# EAGLE design LineSensor (EAGLE 9.7.0)
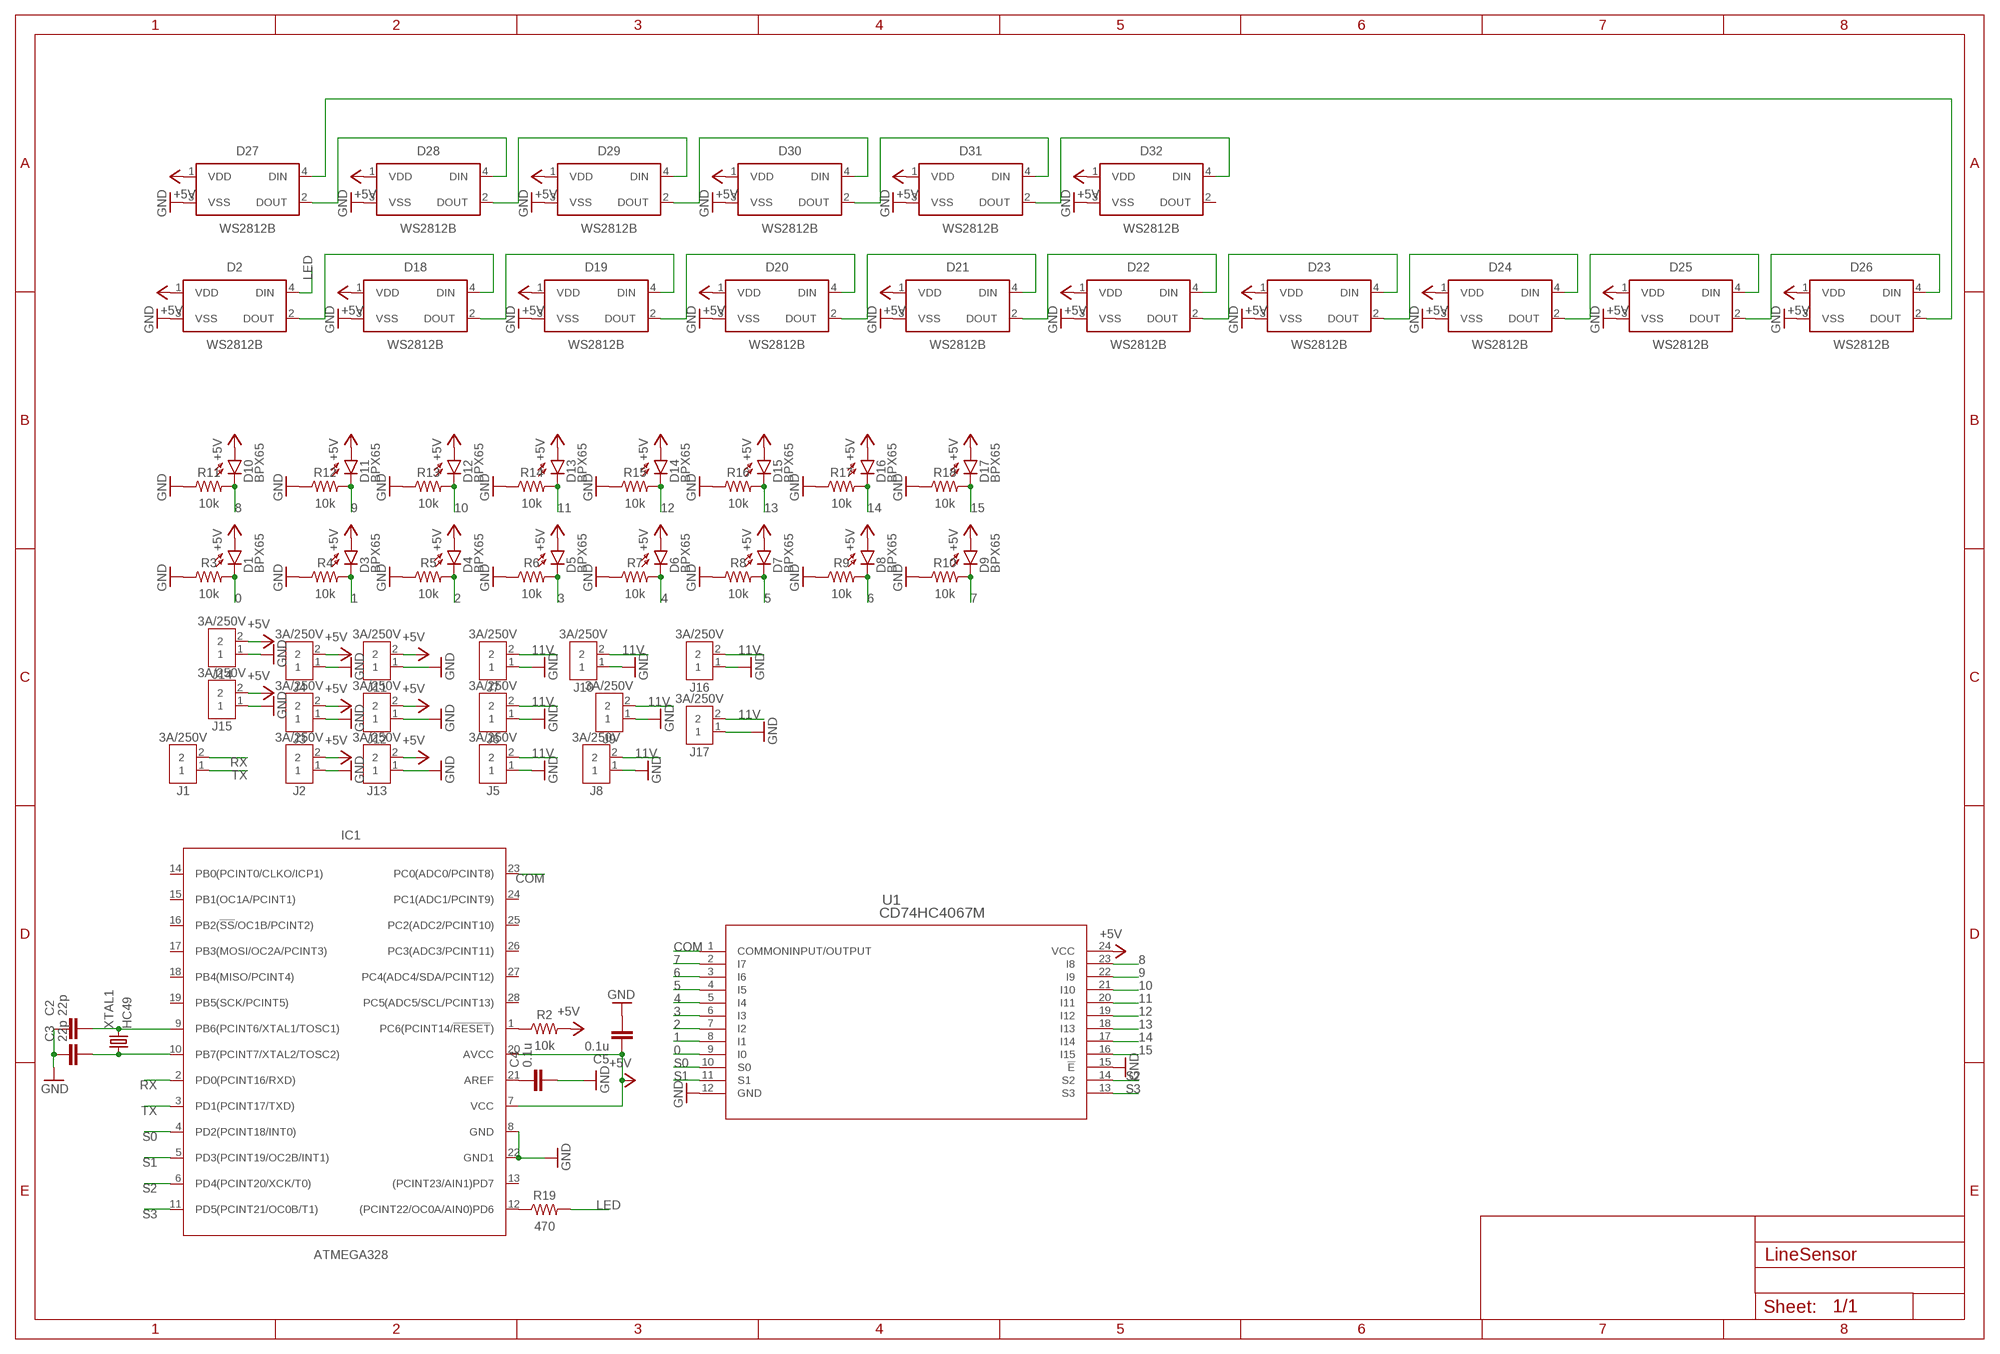
[diagram p0: schematic, sheet 1]

## Parts
C2  22p  C_CHIP-0603(1608-METRIC)  [CAPC1608X85]
C3  22p  C_CHIP-0603(1608-METRIC)  [CAPC1608X85]
C4  0.1u  C_CHIP-0603(1608-METRIC)  [CAPC1608X85]
C5  0.1u  C_CHIP-0603(1608-METRIC)  [CAPC1608X85]
D1  BPX65  [BPX65]
D2  WS2812B  [WS2812B]
D3  BPX65  [BPX65]
D4  BPX65  [BPX65]
D5  BPX65  [BPX65]
D6  BPX65  [BPX65]
D7  BPX65  [BPX65]
D8  BPX65  [BPX65]
D9  BPX65  [BPX65]
D10  BPX65  [BPX65]
D11  BPX65  [BPX65]
D12  BPX65  [BPX65]
D13  BPX65  [BPX65]
D14  BPX65  [BPX65]
D15  BPX65  [BPX65]
D16  BPX65  [BPX65]
D17  BPX65  [BPX65]
D18  WS2812B  [WS2812B]
D19  WS2812B  [WS2812B]
D20  WS2812B  [WS2812B]
D21  WS2812B  [WS2812B]
D22  WS2812B  [WS2812B]
D23  WS2812B  [WS2812B]
D24  WS2812B  [WS2812B]
D25  WS2812B  [WS2812B]
D26  WS2812B  [WS2812B]
D27  WS2812B  [WS2812B]
D28  WS2812B  [WS2812B]
D29  WS2812B  [WS2812B]
D30  WS2812B  [WS2812B]
D31  WS2812B  [WS2812B]
D32  WS2812B  [WS2812B]
IC1  ATMEGA328  ATMEGA328_DIP  [DIP1016W53P254L3467H457Q28B]
J1  3A/250V  B2B-XH-A  [B2B-XH-A]
J2  3A/250V  B2B-XH-A  [B2B-XH-A]
J3  3A/250V  B2B-XH-A  [B2B-XH-A]
J4  3A/250V  B2B-XH-A  [B2B-XH-A]
J5  3A/250V  B2B-XH-A  [B2B-XH-A]
J6  3A/250V  B2B-XH-A  [B2B-XH-A]
J7  3A/250V  B2B-XH-A  [B2B-XH-A]
J8  3A/250V  B2B-XH-A  [B2B-XH-A]
J9  3A/250V  B2B-XH-A  [B2B-XH-A]
J10  3A/250V  B2B-XH-A  [B2B-XH-A]
J11  3A/250V  B2B-XH-A  [B2B-XH-A]
J12  3A/250V  B2B-XH-A  [B2B-XH-A]
J13  3A/250V  B2B-XH-A  [B2B-XH-A]
J14  3A/250V  B2B-XH-A  [B2B-XH-A]
J15  3A/250V  B2B-XH-A  [B2B-XH-A]
J16  3A/250V  B2B-XH-A  [B2B-XH-A]
J17  3A/250V  B2B-XH-A  [B2B-XH-A]
R2  10k  R-US_CHIP-0603(1608-METRIC)  [RESC1608X60]
R3  10k  R-US_CHIP-0603(1608-METRIC)  [RESC1608X60]
R4  10k  R-US_CHIP-0603(1608-METRIC)  [RESC1608X60]
R5  10k  R-US_CHIP-0603(1608-METRIC)  [RESC1608X60]
R6  10k  R-US_CHIP-0603(1608-METRIC)  [RESC1608X60]
R7  10k  R-US_CHIP-0603(1608-METRIC)  [RESC1608X60]
R8  10k  R-US_CHIP-0603(1608-METRIC)  [RESC1608X60]
R9  10k  R-US_CHIP-0603(1608-METRIC)  [RESC1608X60]
R10  10k  R-US_CHIP-0603(1608-METRIC)  [RESC1608X60]
R11  10k  R-US_CHIP-0603(1608-METRIC)  [RESC1608X60]
R12  10k  R-US_CHIP-0603(1608-METRIC)  [RESC1608X60]
R13  10k  R-US_CHIP-0603(1608-METRIC)  [RESC1608X60]
R14  10k  R-US_CHIP-0603(1608-METRIC)  [RESC1608X60]
R15  10k  R-US_CHIP-0603(1608-METRIC)  [RESC1608X60]
R16  10k  R-US_CHIP-0603(1608-METRIC)  [RESC1608X60]
R17  10k  R-US_CHIP-0603(1608-METRIC)  [RESC1608X60]
R18  10k  R-US_CHIP-0603(1608-METRIC)  [RESC1608X60]
R19  470  R-US_CHIP-0603(1608-METRIC)  [RESC1608X60]
U1  CD74HC4067M  [DW24]
XTAL1  HC49  CRYSTAL_HC49-11.5L  [XTALRR488W45L1150T500H350B]

## Nets
0: D1.K(C) R3.2 U1.9(I0)
1: D3.K(C) R4.2 U1.8(I1)
2: D4.K(C) R5.2 U1.7(I2)
3: D5.K(C) R6.2 U1.6(I3)
4: D6.K(C) R7.2 U1.5(I4)
5: D7.K(C) R8.2 U1.4(I5)
6: D8.K(C) R9.2 U1.3(I6)
7: D9.K(C) R10.2 U1.2(I7)
8: D10.K(C) R11.2 U1.23(I8)
9: D11.K(C) R12.2 U1.22(I9)
10: D12.K(C) R13.2 U1.21(I10)
11: D13.K(C) R14.2 U1.20(I11)
11V [11V]: J5.2 J6.2 J7.2 J8.2 J9.2 J10.2 J16.2 J17.2
12: D14.K(C) R15.2 U1.19(I12)
13: D15.K(C) R16.2 U1.18(I13)
14: D16.K(C) R17.2 U1.17(I14)
15: D17.K(C) R18.2 U1.16(I15)
+5V [power]: C5.1 D1.A D2.1(VDD) D3.A D4.A D5.A D6.A D7.A D8.A D9.A D10.A D11.A D12.A D13.A D14.A D15.A D16.A D17.A D18.1(VDD) D19.1(VDD) D20.1(VDD) D21.1(VDD) D22.1(VDD) D23.1(VDD) D24.1(VDD) D25.1(VDD) D26.1(VDD) D27.1(VDD) D28.1(VDD) D29.1(VDD) D30.1(VDD) D31.1(VDD) D32.1(VDD) IC1.7(VCC) IC1.20(AVCC) J2.2 J3.2 J4.2 J11.2 J12.2 J13.2 J14.2 J15.2 R2.2 U1.24(VCC)
COM: IC1.23(PC0(ADC0/PCINT8)) U1.1(COMMONINPUT/OUTPUT)
GND [power]: C2.1 C3.1 C4.2 C5.2 D2.3(VSS) D18.3(VSS) D19.3(VSS) D20.3(VSS) D21.3(VSS) D22.3(VSS) D23.3(VSS) D24.3(VSS) D25.3(VSS) D26.3(VSS) D27.3(VSS) D28.3(VSS) D29.3(VSS) D30.3(VSS) D31.3(VSS) D32.3(VSS) IC1.8(GND) IC1.22(GND1) J2.1 J3.1 J4.1 J5.1 J6.1 J7.1 J8.1 J9.1 J10.1 J11.1 J12.1 J13.1 J14.1 J15.1 J16.1 J17.1 R3.1 R4.1 R5.1 R6.1 R7.1 R8.1 R9.1 R10.1 R11.1 R12.1 R13.1 R14.1 R15.1 R16.1 R17.1 R18.1 U1.12(GND) U1.15(!E)
LED: D2.4(DIN) R19.2
N$1: C2.2 IC1.9(PB6(PCINT6/XTAL1/TOSC1)) XTAL1.2
N$2: C3.2 IC1.10(PB7(PCINT7/XTAL2/TOSC2)) XTAL1.1
N$3: C4.1 IC1.21(AREF)
N$4: IC1.1(PC6(PCINT14/!RESET!)) R2.1
N$5: D2.2(DOUT) D18.4(DIN)
N$6: D18.2(DOUT) D19.4(DIN)
N$7: D19.2(DOUT) D20.4(DIN)
N$8: D20.2(DOUT) D21.4(DIN)
N$9: D21.2(DOUT) D22.4(DIN)
N$10: D22.2(DOUT) D23.4(DIN)
N$11: D23.2(DOUT) D24.4(DIN)
N$12: D24.2(DOUT) D25.4(DIN)
N$13: D25.2(DOUT) D26.4(DIN)
N$14: D26.2(DOUT) D27.4(DIN)
N$15: D27.2(DOUT) D28.4(DIN)
N$16: D28.2(DOUT) D29.4(DIN)
N$17: D29.2(DOUT) D30.4(DIN)
N$18: D30.2(DOUT) D31.4(DIN)
N$19: D31.2(DOUT) D32.4(DIN)
N$20: IC1.12((PCINT22/OC0A/AIN0)PD6) R19.1
RX: IC1.2(PD0(PCINT16/RXD)) J1.2
S0: IC1.4(PD2(PCINT18/INT0)) U1.10(S0)
S1: IC1.5(PD3(PCINT19/OC2B/INT1)) U1.11(S1)
S2: IC1.6(PD4(PCINT20/XCK/T0)) U1.14(S2)
S3: IC1.11(PD5(PCINT21/OC0B/T1)) U1.13(S3)
TX: IC1.3(PD1(PCINT17/TXD)) J1.1
Unconnected: D32.2(DOUT) IC1.13((PCINT23/AIN1)PD7) IC1.14(PB0(PCINT0/CLKO/ICP1)) IC1.15(PB1(OC1A/PCINT1)) IC1.16(PB2(!SS!/OC1B/PCINT2)) IC1.17(PB3(MOSI/OC2A/PCINT3)) IC1.18(PB4(MISO/PCINT4)) IC1.19(PB5(SCK/PCINT5)) IC1.24(PC1(ADC1/PCINT9)) IC1.25(PC2(ADC2/PCINT10)) IC1.26(PC3(ADC3/PCINT11)) IC1.27(PC4(ADC4/SDA/PCINT12)) IC1.28(PC5(ADC5/SCL/PCINT13))

## Library data of the parts
C2-C5 = Capacitor:C: Capacitor - Generic; CATEGORY: Capacitor
D1 D3-D17 = opto-trans-siemens:BPX65: PHOTO DIODE; MPN: BPX65.; OC_FARNELL: 327451; OC_NEWARK: 06WX2764
D2 D18-D32 = LED:WS2812B: Intelligent control LED integrated light source Datasheet <http://cdn.sparkfun.com/datasheets/BreakoutBoards/WS2812B.pdf>; CATEGORY: LED; COLOR: RGB; DESCRIPTION: LED integrated light source; MANUFACTURER: Worldsemi; MPN: WS2812B; OPERATING_TEMP: -25 ℃ to +80℃(TJ); PART_STATUS: Active; SUB_CATEGORY: RGB
IC1 = IC_Embedded:ATMEGA328: 8-bit AVR Microcontroller with 32K Bytes In-System Programmable Flash Datasheet <http://ww1.microchip.com/downloads/en/DeviceDoc/ATmega48A-PA-88A-PA-168A-PA-328-P-DS-DS40002061A.pdf>; CATEGORY: IC_Embedded; MANUFACTURER: Microchip Technologies; MPN: ATmega328-PN; OPERATING_TEMP: –40 to +105°C; PART_STATUS: Active; SUB-CATEGORY: Microcontroller
J1-J17 = Connector:B2B-XH-A: XH Connector Top Entry - 2POS Details see: Datasheet <http://www.jst-mfg.com/product/pdf/eng/eXH.pdf>; CATEGORY: CONNECTOR; DESCRIPTION: 2.5mm pitch/disconnectable crimp style connector; MANUFACTURER: JST (XH CONNECTOR); MPN: B2B-XH-A; OPERATING_TEMPERATURE: -25°C ~ 85°C; PART_STATUS: ACTIVE; ROHS_COMPLIANT: COMPLIANT; SERIES: B_B-XH-A; SUB_CATEGORY: Through hole connector; TYPE: top entry
R2-R19 = Resistor:R-US: Resistor Fixed - ANSI; CATEGORY: Resistor; SUB-CATEGORY: Fixed
U1 = CD74HC4067:CD74HC4067M; COPYRIGHT: Copyright (C) 2022 Ultra Librarian. All rights reserved.; MANUFACTURER_PART_NUMBER: CD74HC4067M; MFR_NAME: Texas Instruments
XTAL1 = Frequency-Source:CRYSTAL: Crystal 2Pin - Generic; CATEGORY: Frequency-Source; SUB-CATEGORY: Crystal-2Pin

## Net classes
1 11V: width 3.302 mm
2 power: width 1.27 mm

## Board
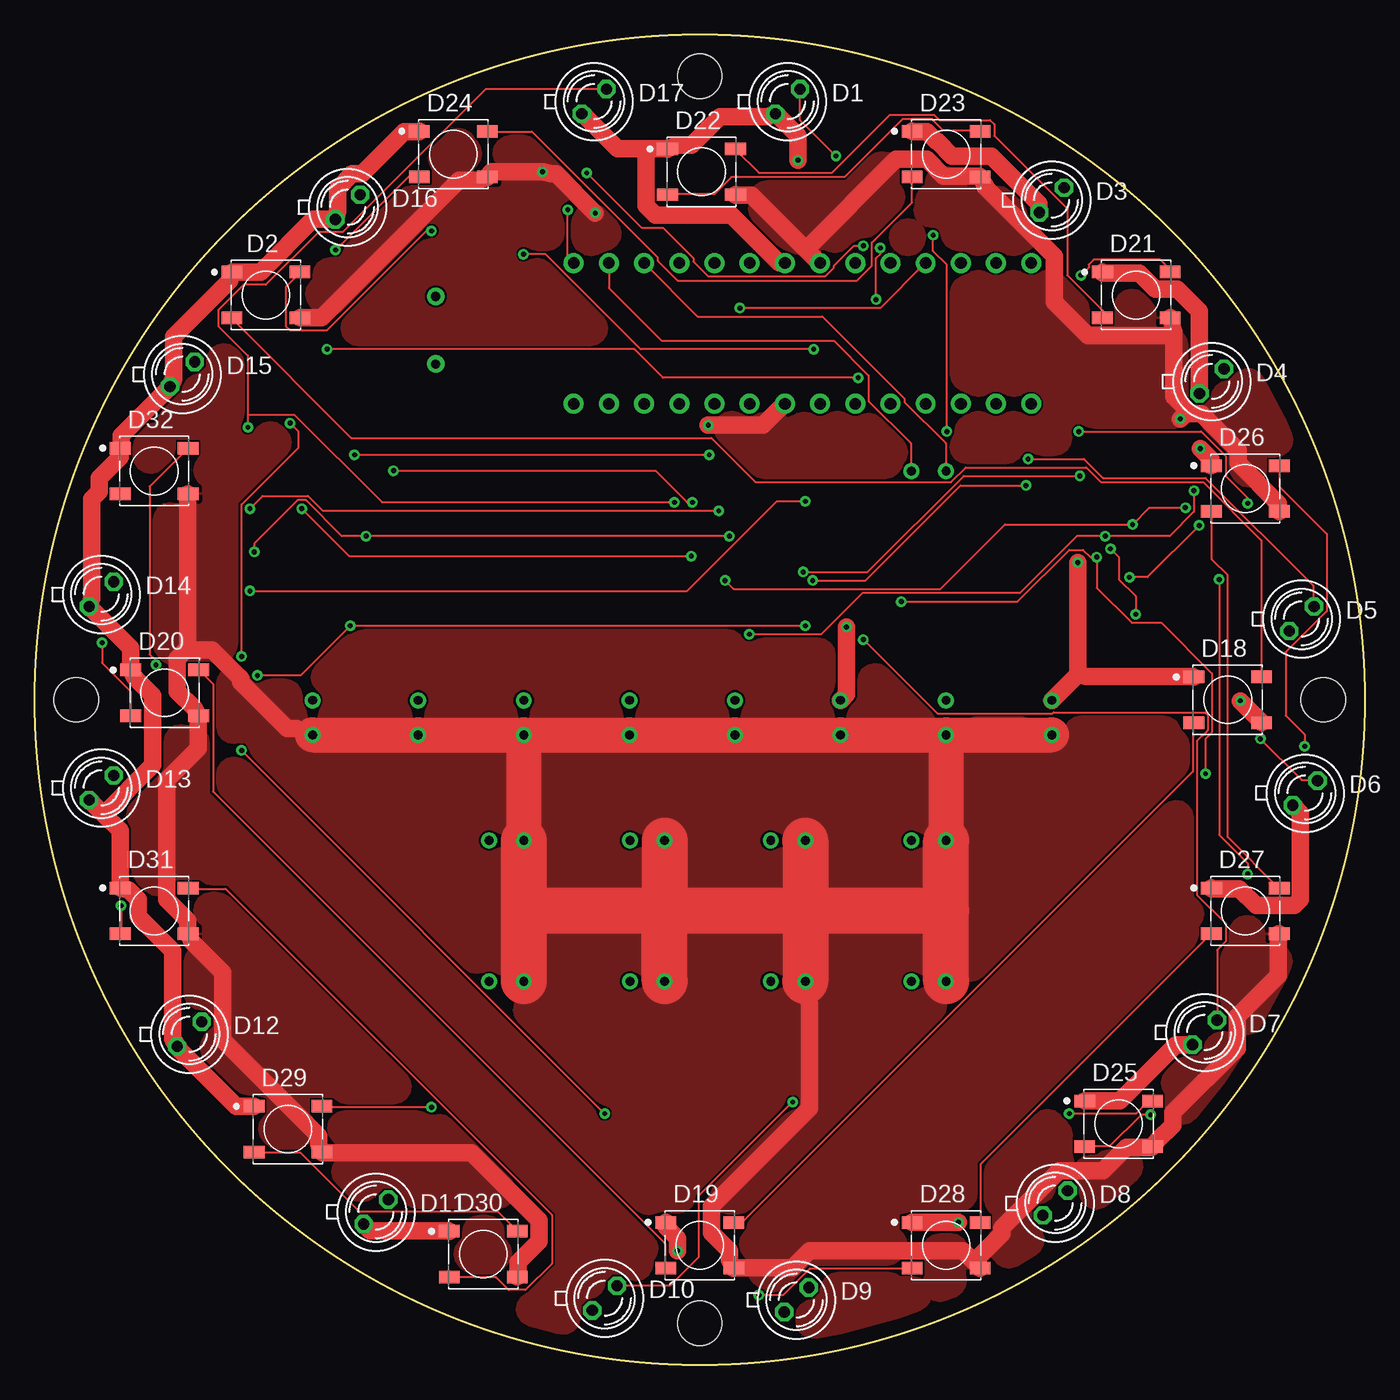
[diagram p1: board, top side]
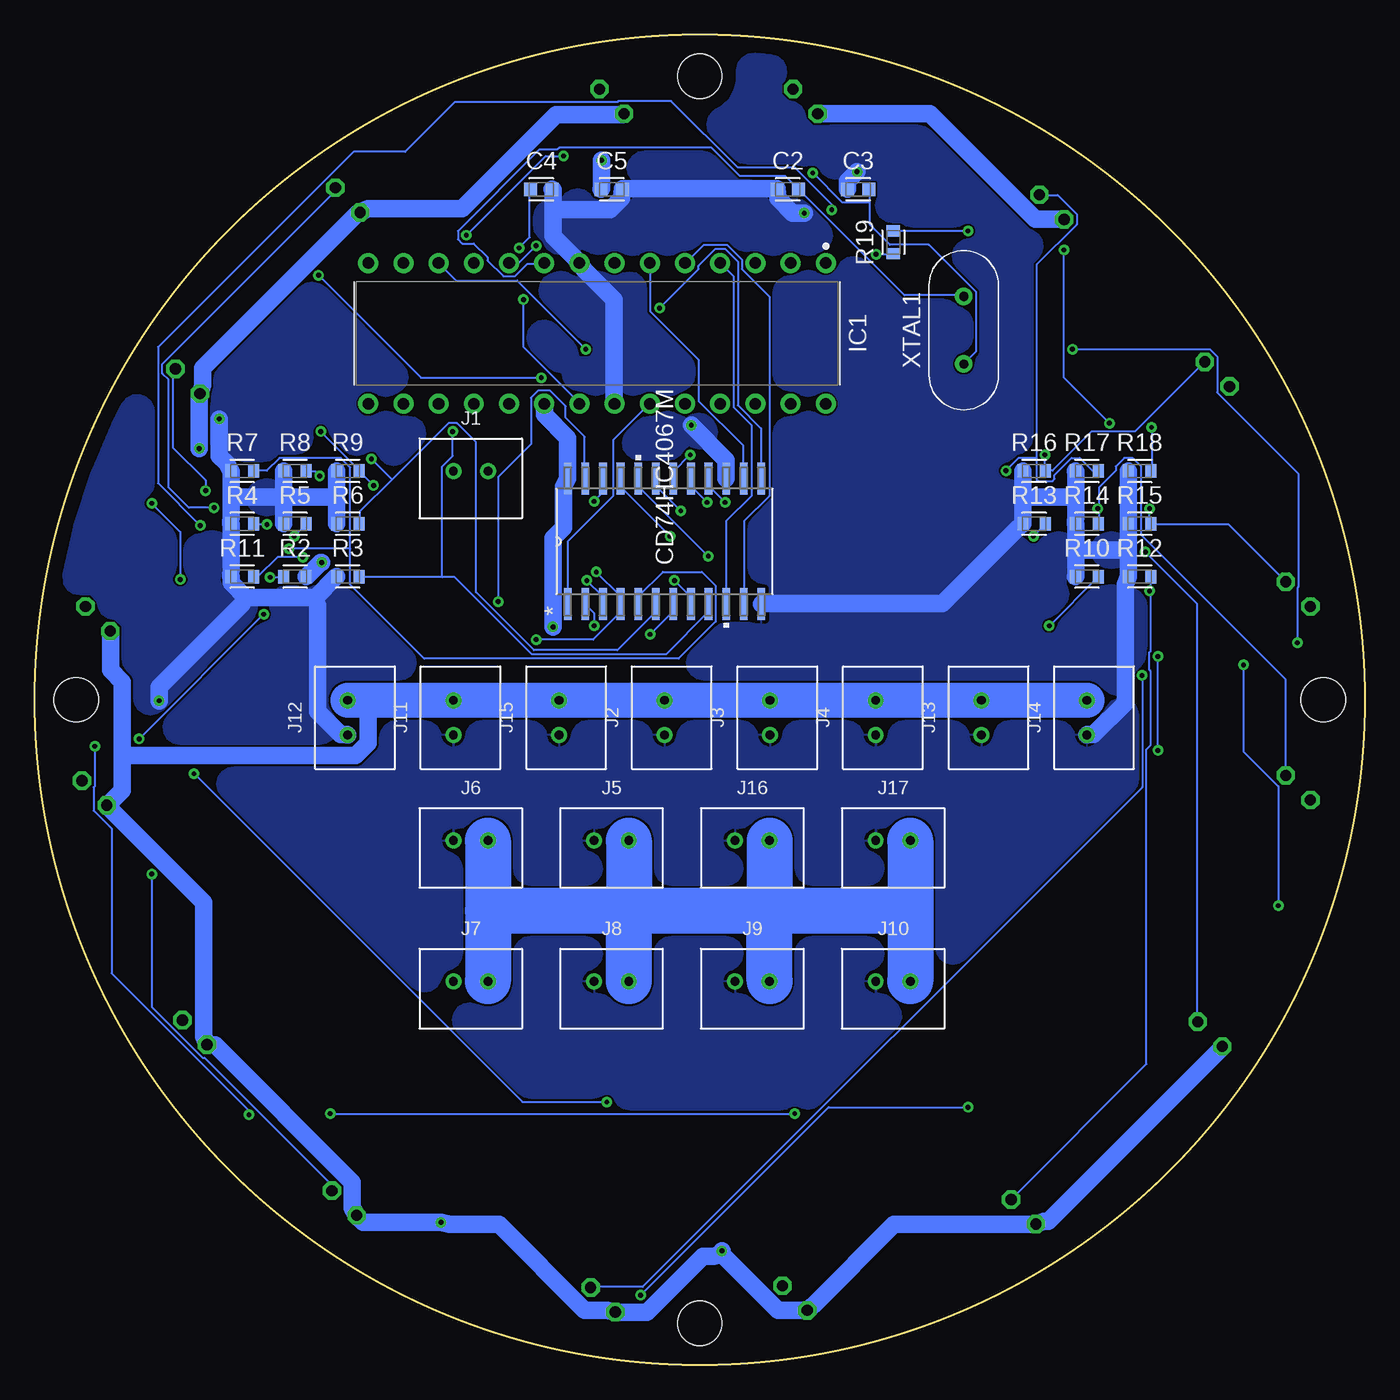
[diagram p2: board, bottom side, seen from below]

Size 96 x 96 mm. Coordinates in mm from the lower left corner, seen from the top.
Outline: circle at 48,48 radius 48
Copper layers (1*16): Top 0.035mm / dielectric 1.5mm / Bottom 0.035mm
Design rules "default": minimum track width 6mil, minimum drill 0.35mm, track to track 6mil, track to pad 6mil, pad to pad 6mil, via to via 6mil, smd to smd 6mil, copper to edge 40mil, drill to drill 6mil, minimum pad ring 10mil, minimum via ring 8mil, stop-mask expansion 4mil, vias tented up to drill 0mil, thermal gap 10mil
Holes 3.2 mm at 3,48 48,3 93,48 48,93

### Footprints (pad centres in the part's own frame; a part is rotated, then mirrored left to right if it is on the bottom)
CAPC1608X85 = smd 0.921 x 0.97: 1 -0.775,0; 2 0.775,0
BPX65 = drill 0.813 octagon: A -0.889,-0.889; K 0.889,0.889
WS2812B = smd 1.5 x 0.9: 1 -2.45,1.65; 2 -2.45,-1.65; 3 2.45,-1.65; 4 2.45,1.65
DIP1016W53P254L3467H457Q28B = drill 0.841 pad 1.441: 1 -5.08,16.51; 2 -5.08,13.97; 3 -5.08,11.43; 4 -5.08,8.89; 5 -5.08,6.35; 6 -5.08,3.81; 7 -5.08,1.27; 8 -5.08,-1.27; 9 -5.08,-3.81; 10 -5.08,-6.35; 11 -5.08,-8.89; 12 -5.08,-11.43; 13 -5.08,-13.97; 14 -5.08,-16.51; 15 5.08,-16.51; 16 5.08,-13.97; 17 5.08,-11.43; 18 5.08,-8.89; 19 5.08,-6.35; 20 5.08,-3.81; 21 5.08,-1.27; 22 5.08,1.27; 23 5.08,3.81; 24 5.08,6.35; 25 5.08,8.89; 26 5.08,11.43; 27 5.08,13.97; 28 5.08,16.51
B2B-XH-A = drill 0.64: 1 0,0; 2 2.5,0
RESC1608X60 = smd 0.799 x 0.974: 1 -0.815,0; 2 0.815,0
DW24 = smd 2.311 x 0.559: 1 -4.521,6.985; 2 -4.521,5.715; 3 -4.521,4.445; 4 -4.521,3.175; 5 -4.521,1.905; 6 -4.521,0.635; 7 -4.521,-0.635; 8 -4.521,-1.905; 9 -4.521,-3.175; 10 -4.521,-4.445; 11 -4.521,-5.715; 12 -4.521,-6.985; 13 4.521,-6.985; 14 4.521,-5.715; 15 4.521,-4.445; 16 4.521,-3.175; 17 4.521,-1.905; 18 4.521,-0.635; 19 4.521,0.635; 20 4.521,1.905; 21 4.521,3.175; 22 4.521,4.445; 23 4.521,5.715; 24 4.521,6.985
XTALRR488W45L1150T500H350B = drill 0.657 pad 1.257: 1 -2.44,0; 2 2.44,0

### Placement (x,y rotation side)
C2  41.65,84.83 0 bottom
C3  36.57,84.83 0 bottom
C4  59.43,84.83 0 bottom
C5  54.35,84.83 0 bottom
D1  54.35,91.18 0 top
D2  16.69,77.21 0 top
D3  73.4,84.07 0 top
D4  84.96,70.99 0 top
D5  91.43,53.84 0 top
D6  91.69,41.27 0 top
D7  84.45,24 0 top
D8  73.65,11.68 0 top
D9  54.98,4.69 0 top
D10  41.14,4.82 0 top
D11  24.63,11.04 0 top
D12  11.17,23.87 0 top
D13  4.82,41.65 0 top
D14  4.82,55.62 0 top
D15  10.66,71.5 0 top
D16  22.6,83.56 0 top
D17  40.38,91.18 0 top
D18  86.1,48 0 top
D19  48,8.63 0 top
D20  9.39,48.51 0 top
D21  79.5,77.21 0 top
D22  48.13,86.1 0 top
D23  65.78,87.37 0 top
D24  30.22,87.37 0 top
D25  78.23,17.39 0 top
D26  87.37,63.24 0 top
D27  87.37,32.76 0 top
D28  65.78,8.63 0 top
D29  18.28,17.01 0 top
D30  32.38,7.99 0 top
D31  8.63,32.76 0 top
D32  8.63,64.51 0 top
IC1  55.41,74.44 270 bottom
J1  65.78,64.51 0 bottom
J2  50.54,45.46 90 bottom
J3  42.92,45.46 90 bottom
J4  35.3,45.46 90 bottom
J5  55.62,37.84 0 bottom
J6  65.78,37.84 0 bottom
J7  65.78,27.68 0 bottom
J8  55.62,27.68 0 bottom
J9  45.46,27.68 0 bottom
J10  35.3,27.68 0 bottom
J11  65.78,45.46 90 bottom
J12  73.4,45.46 90 bottom
J13  27.68,45.46 90 bottom
J14  20.06,45.46 90 bottom
J15  58.16,45.46 90 bottom
J16  45.46,37.84 0 bottom
J17  35.3,37.84 0 bottom
R2  77.21,56.89 0 bottom
R3  73.4,56.89 0 bottom
R4  81.02,60.7 0 bottom
R5  77.21,60.7 0 bottom
R6  73.4,60.7 0 bottom
R7  81.02,64.51 0 bottom
R8  77.21,64.51 0 bottom
R9  73.4,64.51 0 bottom
R10  20.06,56.89 0 bottom
R11  81.02,56.89 0 bottom
R12  16.25,56.89 0 bottom
R13  23.87,60.7 0 bottom
R14  20.06,60.7 0 bottom
R15  16.25,60.7 0 bottom
R16  23.87,64.51 0 bottom
R17  20.06,64.51 0 bottom
R18  16.25,64.51 0 bottom
R19  34.03,81.02 90 bottom
U1  50.54,59.43 90 bottom
XTAL1  28.95,74.67 90 bottom

### Tracks (layer width: path | path; a pad name or v marks a point on that pad's centre or on a via)
0  (via drill 0.35)
  Top 0.152: D1.K 55.24,89.83 v57.83,87.24 | v64.84,81.53 64.84,80.38 65.83,79.39 v65.83,67.36
  Bottom 0.152: 66.59,56.84 65.68,56.84 60.12,51.28 50.44,51.28 47.39,54.33 47.39,54.86 U1.9 | 66.59,56.84 72.54,56.84 R3.2 | v57.83,87.24 59.12,87.24 v64.84,81.53 | v65.83,67.36 65.83,65.6 66.59,64.84 66.59,56.84
1  (via drill 0.35)
  Top 0.152: v49.83,56.61 50.44,56 65.37,56 70.02,60.65 v79.24,60.65 80.46,61.87 v83.05,61.87
  Bottom 0.152: v79.24,60.65 80.16,60.65 R4.2 | v49.83,56.61 48.69,55.47 48.69,54.93 U1.8 | D3.K 74.29,84.73 86.79,72.23 86.79,71.55 86.33,71.09 86.33,63.32 84.88,61.87 v83.05,61.87
2  (via drill 0.35)
  Top 0.152: v83.66,63.09 83.66,61.56 81.91,59.81 v77.26,59.81 75.2,59.81 71.09,55.7 59.73,55.7 56.76,52.72 v51.58,52.72
  Bottom 0.152: v77.26,59.81 76.42,60.65 R5.2 | v83.66,63.09 83.66,63.85 86.02,66.21 86.02,71.7 D4.K | U1.7 49.91,54.4 v51.58,52.72
3  (via drill 0.35)
  Top 0.152: v71.7,65.37 75.74,65.37 77.11,64 84.5,64 92.27,56.23 92.27,54.78 D5.K
  Bottom 0.152: 70.21,63.89 66.14,67.96 65.53,67.96 64.15,66.59 64.15,55.77 59.96,51.58 53.94,51.58 51.2,54.33 51.2,54.86 U1.6 | 70.21,63.89 72.54,61.56 72.54,60.73 R6.2 | 70.21,63.89 v71.7,65.37
4  (via drill 0.35)
  Top 0.152: v88.46,45.18 91.43,42.21 92.58,42.21 D6.K | v79.47,54.17 79.47,55.47 78.25,56.69 78.25,58.29 v77.64,58.9
  Bottom 0.152: 73.22,58.9 73.22,56.31 67.89,50.97 49.52,50.97 46.86,53.64 46.86,56.23 47.85,57.22 50.67,57.22 52.42,55.47 52.42,54.93 U1.5 | 73.22,58.9 73.22,64.76 73.91,65.45 78.33,65.45 79.24,64.53 80.16,64.53 R7.2 | v79.47,54.17 v88.46,45.18 | 73.22,58.9 v77.64,58.9
5  (via drill 0.35)
  Top 0.152: v75.43,64.15 67.05,64.15 60.12,57.22 v55.47,57.22 | D7.K 85.34,29.94 85.95,30.55 85.95,31.85 83.89,33.9 83.89,45.03 84.65,45.79 84.65,46.93 84.5,47.09 73.53,47.09 73.45,47.01 65.14,47.01 v59.81,52.34
  Bottom 0.152: v75.43,64.15 75.74,64.46 76.35,64.46 R8.2 | v55.47,57.22 53.72,55.47 U1.4 53.72,54.33 55.7,52.34 v59.81,52.34
6  (via drill 0.35)
  Top 0.152: v71.55,63.47 66.82,63.47 59.96,56.61 v56.15,56.61 | v87.55,35.43 87.55,36.19 85.49,38.25 v85.49,56.69 | v87.55,62.17 87.55,62.55 85.95,64.15 85.95,65.6 84.19,67.36 v75.36,67.36
  Bottom 0.152: v71.55,63.47 72.54,64.46 R9.2 72.54,64.53 v75.36,67.36 | v56.15,56.61 55.01,55.47 55.01,54.93 U1.3 | v87.55,35.43 87.55,25.83 83.89,22.17 83.74,22.17 74.59,13.02 74.59,12.57 D8.K | v85.49,56.69 85.49,60.12 v87.55,62.17
7  (via drill 0.35)
  Top 0.152: v55.62,53.33 v22.78,53.33 19.2,49.75 v16.07,49.75
  Bottom 0.152: v22.78,53.33 19.27,56.84 R10.2 | v55.62,53.33 55.62,54.25 56.23,54.86 U1.2 | v16.07,49.75 16.07,41.67 52.12,5.63 55.85,5.63 D9.K
8  (via drill 0.35)
  Top 0.152: v62.55,55.09 70.94,55.09 74.67,58.82 75.66,58.82 76.19,58.29 v76.65,58.29 76.65,56.08 79.17,53.56 81.3,53.56 84.96,49.91 84.96,45.64 84.5,45.18 v84.5,42.67 | D10.K 45.87,5.71 47.92,7.77 47.92,12.19 v54.71,18.97
  Bottom 0.152: v76.65,58.29 78.48,58.29 79.85,56.91 80.16,56.91 R11.2 | v62.55,55.09 62.55,64.08 60.19,66.44 60.19,69.79 59.66,70.33 58.82,70.33 57.68,69.18 57.68,68.34 56.31,66.97 56.31,64 U1.23 | v54.71,18.97 60.8,18.97 v84.5,42.67
9  (via drill 0.35)
  Top 0.152: v55.62,62.33 53.56,62.33 47.09,55.85 v15.54,55.85
  Bottom 0.152: 15.46,55.85 15.46,51.51 15.54,51.43 15.54,50.13 15.46,50.06 15.46,44.72 15.77,44.42 15.77,21.71 25.52,11.96 D11.K | 15.46,55.85 15.46,56.84 R12.2 | v55.62,62.33 55.01,62.94 55.01,63.93 U1.22 | 15.46,55.85 v15.54,55.85
10  (via drill 0.35)
  Top 0.152: v50.13,59.81 v23.92,59.81 22.17,59.81 19.58,62.4 18.97,62.4 15.84,59.28 v15.84,58.67
  Bottom 0.152: v23.92,59.81 23.08,60.65 R13.2 | v50.13,59.81 53.72,63.39 U1.21 | v15.84,58.67 12.11,54.93 12.11,24.76 D12.K
11  (via drill 0.35)
  Top 0.152: v47.39,58.36 22.7,58.36 v19.27,61.79
  Bottom 0.152: 19.2,61.79 19.2,63.32 17.98,64.53 17.98,64.84 17.37,65.45 16.76,65.45 16.15,64.84 16.15,59.89 5.71,49.45 D13.K | 19.2,61.79 19.2,60.73 R14.2 | v47.39,58.36 52.42,63.39 52.42,63.93 U1.20 | 19.2,61.79 v19.27,61.79
11V
  Bottom 3.302: J17.2 32.8,32.76 | 32.8,32.76 J10.2 | J16.2 42.96,32.76 | J9.2 42.96,32.76 | J5.2 53.12,32.76 | J8.2 53.12,32.76 | J6.2 63.28,32.76 | 63.28,32.76 J7.2 | 32.8,32.76 42.96,32.76 | 42.96,32.76 53.12,32.76 | 53.12,32.76 63.28,32.76
12  (via drill 0.35)
  Top 0.152: v49.37,61.64 20.8,61.64 19.73,62.71 16.45,62.71 v15.54,61.79
  Bottom 0.152: D14.K 5.71,56.53 9.82,60.65 15.39,60.65 R15.2 15.46,60.73 15.54,60.8 v15.54,61.79 | v49.37,61.64 51.12,63.39 51.12,63.93 U1.19
13  (via drill 0.35)
  Top 0.152: v23.08,65.68 v48.69,65.68
  Bottom 0.152: D15.K 11.58,72.38 16.61,67.36 19.73,67.36 22.55,64.53 23.01,64.53 R16.2 23.08,64.53 v23.08,65.68 | U1.18 49.91,64.46 v48.69,65.68
14  (via drill 0.35)
  Top 0.152: v47.47,62.25 47.09,62.25 44.8,64.53 v25.9,64.53
  Bottom 0.152: 23.69,65.45 23.69,79.39 20.8,82.29 20.8,83.05 22.17,84.42 23.46,84.42 D16.K | 23.69,65.45 23.69,63.93 23.54,63.77 22.55,63.77 22.4,63.93 22.4,64.23 21.18,65.45 20.57,65.45 19.65,64.53 19.27,64.53 R17.2 | v47.47,62.25 48.61,63.39 48.61,63.93 U1.17 | v25.9,64.53 24.99,65.45 23.69,65.45
15  (via drill 0.35)
  Top 0.152: 15.39,68.57 15.39,72.84 13.25,74.97 13.25,76.12 15.08,77.95 16.68,77.95 20.49,81.76 22.24,81.76 32.53,92.04 41.22,92.04 D17.K | 15.39,68.57 v15.39,67.66 | v46.17,62.25 25.06,62.25 18.74,68.57 15.39,68.57
  Bottom 0.152: v15.39,67.66 15.39,64.53 R18.2 | v46.17,62.25 47.31,63.39 47.31,63.93 U1.16
+5V  (via drill 0.35)
  Top 1.27: D27.1 84.96,34.36 86.94,34.36 88.16,33.14 90.9,33.14 91.36,33.6 91.36,39.85 90.82,40.38 D6.A | 75.28,49.83 v75.28,57.91 | 75.28,49.83 73.45,48 J12.2 | D18.1 83.59,49.68 75.89,49.68 75.28,49.83 | v58.59,53.26 58.59,48.38 58.21,48 J15.2 | D25.1 75.81,19.04 78.33,19.04 82.37,23.08 83.51,23.08 D7.A | v66.67,10.28 63.39,10.28 D28.1 | D11.A 24.23,9.67 29.86,9.67 D30.1 | v46.4,8.22 46.4,9.14 45.56,9.98 45.56,10.2 D19.1 | D23.1 63.39,89 64.38,89 65.07,88.31 65.14,88.31 66.21,87.24 69.03,87.24 72.46,83.81 72.46,83.2 D3.A | v84.12,66.14 84.88,65.37 84.88,64.92 D26.1 | D21.1 77.08,78.78 79.71,78.78 80.87,77.62 82.46,77.62 84.04,76.04 84.04,70.1 D4.A | v55.09,86.94 55.09,88.69 53.49,90.29 D1.A 52.88,90.06 49.45,90.06 47.39,88 46.25,88 D22.1 45.64,87.78 44.11,87.78 | 44.11,87.78 42.06,87.78 39.54,90.29 D17.A | 44.11,87.78 44.11,83.66 44.8,82.98 50.29,82.98 53.72,79.55 54.1,79.55 IC1.7 | D2.1 16.3,78.86 20.11,82.67 D16.A 21.86,83.28 21.86,84.88 22.93,85.95 23.62,85.95 26.66,89 27.73,89 D24.1 | D2.1 | D29.1 15.77,18.66 14.55,18.66 10.28,22.93 D12.A 9.98,23.54 9.98,29.86 7.46,32.38 7.46,33.6 6.78,34.28 D31.1 6.17,34.44 6.17,38.55 4.98,39.73 | 4.98,39.73 3.96,40.76 D13.A | 4.98,39.73 8.53,43.28 8.53,48.3 7.23,49.6 D20.1 6.93,50.21 6.93,51.73 D14.A 4.11,55.31 4.11,62.48 4.64,63.01 4.64,64 6.17,65.53 D32.1 6.24,66.21 6.24,67.05 9.75,70.56 D15.A 10.05,71.16 10.05,74.21 14.09,78.25 D2.1
  Bottom 1.27: 89.68,43.96 89.68,41.45 90.75,40.38 D6.A 90.37,39.92 83.81,33.37 83.81,23.69 D7.A 83.51,23.08 82.98,23.08 73.07,13.18 73.07,11.35 D8.A 72.77,10.74 72.31,10.28 v66.67,10.28 66.06,10.13 62.48,10.13 56.31,3.96 54.71,3.96 D9.A 51.81,3.8 47.77,7.84 47.01,7.84 46.4,7.99 | 89.68,43.96 89.68,49.3 90.52,50.13 90.52,52.95 D5.A | IC1.20 59.2,69.34 59.2,68.57 57.52,66.9 U1.24 57.83,63.39 57.83,60.42 58.59,59.66 v58.59,53.26 | v75.28,57.91 75.36,57.91 76.35,56.91 R2.2 | 89.68,43.96 72.84,43.96 71.93,44.88 71.93,47.96 | 46.4,7.99 v46.4,8.22 | 46.4,7.99 42.36,3.96 40.3,3.96 D10.A 39.77,4.34 33.98,10.13 23.77,10.13 D11.A 23.16,10.36 22.85,10.36 10.28,22.93 D12.A | v84.12,66.14 84.12,70.1 D4.A 83.89,70.71 83.89,71.93 72.69,83.13 72.54,83.13 D3.A 71.93,83.43 65.14,83.43 58.36,90.22 53.56,90.22 53.49,90.29 D1.A | v55.09,86.94 55.09,84.88 C5.1 | D17.A 31.39,90.29 23.77,82.67 D16.A
  Bottom 2.54: J14.2 J13.2 J4.2 J3.2 J2.2 J15.2 J11.2 71.93,47.96 J12.2
COM
  Bottom 0.152: U1.1 57.52,59.43 54.25,62.71 54.25,66.75 51.66,69.34 IC1.23
GND  (via drill 0.35)
  Top 1.27: D30.3 34.89,6.4 34.89,7.38 36.42,8.91 36.42,10.43 31.54,15.31 20.8,15.31 D29.3 20.49,15.92 20.49,16.53 13.56,23.46 13.56,28.34 11.35,30.55 D31.3 11.04,31.16 11.04,32.07 9.52,33.6 9.52,42.21 11.8,44.49 11.8,46.86 | 11.8,46.86 D20.3 | 11.04,51.73 11.04,62.86 D32.3 | 11.04,51.73 10.28,50.97 10.28,48.61 11.5,47.39 11.8,46.86 | D2.3 19.2,75.58 20.72,75.58 30.63,85.49 32.07,85.49 D24.3 32.68,85.8 32.99,86.1 v36.65,86.1 37.26,85.95 37.64,85.95 v40.46,83.13 | v48.61,67.81 52.57,67.81 54.1,69.34 IC1.22 | 55.66,80.5 56.61,79.55 IC1.8 | 55.66,80.5 51.73,84.42 50.59,84.42 D22.3 | 55.66,80.5 62.17,87.01 64.38,87.01 65.6,85.8 68.19,85.8 D23.3 68.57,85.19 68.57,85.03 73.6,80 73.6,76.69 76,74.29 82.21,74.29 | 67.77,7.42 68.19,7 D28.3 | 67.77,7.42 66.97,8.22 55.92,8.22 54.71,7 50.52,7 D19.3 50.13,7.54 50.13,8.22 48.84,9.52 48.84,11.42 55.92,18.51 55.92,26.05 J8.1 | 67.77,7.42 69.79,9.44 69.79,9.9 73.91,14.02 77.11,14.02 78.78,15.69 80.61,15.69 D25.3 81.07,16.23 82.14,17.29 82.14,18.21 86.79,22.85 86.79,25.14 89.76,28.11 89.76,31.08 D27.3 | 83.24,68.84 82.21,69.87 82.21,74.29 | 83.24,68.84 83.43,68.65 84.19,68.65 86.86,65.98 86.86,65.07 89.76,62.17 89.76,61.64 D26.3 | 82.21,74.29 82.21,74.56 D21.3 | v87.01,47.92 88.54,46.4 D18.3 | v82.67,68.27 83.24,68.84 | 11.04,51.73 11.65,51.58 12.8,51.58 14.85,49.52 14.85,49.3 18.21,45.94 18.89,45.94 J14.1
  Top 2.54: J14.1 J13.1 J4.1 | J4.1 J3.1 J2.1 J15.1 J11.1 | J4.1 J17.1 | J11.1 J12.1 | J11.1 J6.1
  Top 3.302: J17.1 35.3,32.76 | 35.3,32.76 J10.1 | J9.1 45.46,32.76 | J16.1 45.46,32.76 | J5.1 55.62,32.76 | 55.62,32.76 J8.1 | J7.1 65.78,32.76 | 65.78,32.76 J6.1 | 65.78,32.76 55.62,32.76 | 55.62,32.76 45.46,32.76 | 45.46,32.76 35.3,32.76
  Bottom 1.27: v36.65,86.1 37.33,85.41 37.33,84.88 C3.1 | U1.15 46.09,65.3 v48.61,67.81 | 58.59,83.36 58.59,81.45 56.69,79.55 IC1.8 56.31,79.01 54.17,76.88 54.17,69.41 IC1.22 | 58.59,83.36 58.59,84.81 C4.2 | 58.59,83.36 54.48,83.36 53.64,84.19 C5.2 53.56,84.88 42.44,84.88 C2.1 42.36,84.19 41.29,83.13 v40.46,83.13 | 74.21,62.63 74.21,64.46 R9.1 | 74.21,62.63 74.21,60.73 R6.1 | 78.02,62.63 78.02,64.46 R8.1 | 78.02,62.63 78.02,60.73 R5.1 | 78.02,62.63 74.21,62.63 | 75.74,55.39 74.29,56.84 R3.1 | 80.77,55.39 75.74,55.39 | 80.77,55.39 81.83,56.46 81.83,56.84 R11.1 81.83,57.52 81.83,60.65 R4.1 81.83,61.34 81.83,62.63 | 81.83,62.63 81.83,64.46 R7.1 82.14,65.07 82.67,65.6 v82.67,68.27 | v87.01,47.92 87.01,48.91 81.07,54.86 80.77,55.39 | 81.83,62.63 78.02,62.63 | 17.06,58.82 17.06,60.65 R15.1 17.06,61.34 17.06,64.46 R18.1 | 17.06,58.82 17.06,56.91 R12.1 17.29,56.31 17.29,47.77 19.58,45.48 20.04,45.48 J14.1 | 24.68,62.63 24.68,64.46 R16.1 | 24.68,62.63 24.68,60.73 R13.1 25.14,60.27 30.47,54.93 43.5,54.93 U1.12 | 20.87,58.82 20.87,60.65 R14.1 20.87,61.34 20.87,62.63 | 20.87,58.82 20.87,56.91 R10.1 | 20.87,62.63 20.87,64.46 R17.1 | 20.87,62.63 24.68,62.63 | 20.87,58.82 17.06,58.82 | 75.74,55.39 75.58,54.78 75.58,47.16 73.91,45.48 73.45,45.48 J12.1
  pour Bottom: 48,94.99 arc90 1.01,48 arc90 48,1.01 arc90 94.99,48 arc90
  pour Top: 48,94.99 arc-90 94.99,48 arc-90 48,1.01 arc-90 1.01,48 arc-90
LED  (via drill 0.35)
  Top 0.152: v28.64,81.83 28.26,81.83 21.1,74.67 18.43,74.67 18.13,74.97 18.13,77.79 19.12,78.78 D2.4
  Bottom 0.152: v28.64,81.83 33.98,81.83 R19.2
N$1
  Bottom 0.152: XTAL1.2 28.95,77.19 33.22,77.19 40.84,84.81 C2.2 40.91,84.88 41.83,85.8 45.1,85.8 47.16,87.85 58.13,87.85 58.29,87.7 59.58,87.7 65.45,81.83 65.45,81.22 65.14,80.92 64.31,80.92 63.32,79.93 63.32,79.7 62.17,78.56 61.34,78.56 60.42,79.47 59.28,79.47 IC1.9
N$2  (via drill 0.35)
  Top 0.152: v59.81,80.77 59.12,80.77 57.68,79.32 57.68,79.17 57.07,78.56 48.61,78.56 47.54,79.62 47.54,79.85 45.33,82.06 43.81,82.06 v39.85,86.02
  Bottom 0.152: 35.73,83.89 35.73,82.29 34.28,80.84 31.46,80.84 28.04,77.41 28.04,73.15 XTAL1.1 | 35.73,83.89 35.73,84.81 C3.2 | v59.81,80.77 61.03,79.55 61.72,79.55 IC1.10 | v39.85,86.02 37.71,83.89 35.73,83.89
N$3  (via drill 0.35)
  Top 0.152: v61.03,80.61 61.03,80.16 60.73,79.85 v60.73,76.88
  Bottom 0.152: v61.03,80.61 60.27,81.38 60.27,84.81 C4.1 | v60.73,76.88 60.73,73.45 56.69,69.41 IC1.21
N$4  (via drill 0.35)
  Top 0.152: v79.01,56.84 80.31,56.84 v84.04,60.57 | v38.48,83.36 38.48,79.93 38.86,79.55 IC1.1
  Bottom 0.152: v79.01,56.84 78.1,56.84 R2.1 | v84.04,60.57 87.09,63.62 87.09,73.45 72.99,87.55 69.26,87.55 65.68,91.13 53.94,91.13 53.87,91.2 50.06,91.2 45.26,86.41 41.14,86.41 38.48,83.74 v38.48,83.36
N$5
  Top 0.152: D18.4 88.54,49.68 88.54,59.51 84.35,63.7 76.96,63.7 75.89,64.76 67.2,64.76 66.14,63.7 52.04,63.7 48.84,66.9 22.85,66.9 14.24,75.51 D2.2
N$6
  Top 0.152: D19.4 50.52,10.28 51.05,10.28 83.59,42.82 83.59,46.32 D18.2
N$7
  Top 0.152: D19.2 45.48,7 45.48,8.76 12.87,41.37 12.87,49.14 11.88,50.13 D20.4
N$8  (via drill 0.35)
  Top 0.152: v4.87,52.12 4.87,50.67 6.93,48.61 6.93,46.93 D20.2 | v21.1,73.3 43.28,73.3 45.33,71.24 v59.43,71.24 | D21.4 81.94,79.06 81.22,79.78 76.44,79.78 76.07,79.41 76.07,79.19 v75.51,78.63
  Bottom 0.152: v4.87,52.12 4.87,56.08 4.8,56.15 4.8,64.31 10.66,70.17 10.66,72.77 11.2,73.3 v21.1,73.3 | v59.43,71.24 68.12,71.24 v75.51,78.63
N$9
  Top 0.152: D21.2 77.26,75.69 77.26,75.89 74.52,78.63 74.52,83.43 69.26,88.69 69.26,89.53 68.95,89.83 65.3,89.83 64.92,90.22 61.72,90.22 57.52,86.02 52.27,86.02 50.59,87.7 D22.4
N$10
  Top 0.152: D22.2 45.71,84.5 49.07,84.5 50.29,85.72 58.44,85.72 62.63,89.91 64.76,89.91 65.6,89.07 68.19,89.07 D23.4
N$11
  Top 0.152: D23.2 63.32,85.72 63.32,83.89 60.42,81 60.42,79.32 59.35,78.25 46.4,78.25 44.95,79.7 44.95,79.93 35.88,89 32.68,89 D24.4
N$12  (via drill 0.35)
  Top 0.152: v21.71,80.46 26.97,85.72 27.73,85.72 D24.2 | v18.43,67.96 19.04,67.36 19.04,66.21 14.93,62.1 v14.93,51.12 | v41.14,18.13 v14.93,44.34 | v74.67,18.13 79.47,18.13 80.31,18.97 80.61,18.97 D25.4
  Bottom 0.152: v21.71,80.46 21.71,71.24 v18.43,67.96 | v14.93,44.34 v14.93,51.12 | v74.67,18.13 v41.14,18.13
N$13  (via drill 0.35)
  Top 0.152: v80.54,18.05 79.85,18.05 77.57,15.77 75.81,15.77 D25.2 | v91.66,44.65 91.66,45.48 90.29,46.86 90.29,51.43 93.26,54.4 93.26,59.96 89.83,63.39 89.83,64.84 D26.4
  Bottom 0.152: v80.54,18.05 80.54,18.36 90.44,28.26 90.44,38.7 91.74,40 91.74,41.67 91.66,41.75 v91.66,44.65
N$14
  Top 0.152: D26.2 84.96,61.56 84.96,58.13 86.1,56.99 86.1,38.09 89.76,34.44 D27.4
N$15
  Top 0.152: D28.4 68.27,10.28 68.27,14.47 84.88,31.08 D27.2
N$16  (via drill 0.35)
  Top 0.152: v28.64,18.59 20.8,18.59 D29.4 | v52.27,5.02 54.02,5.02 55.92,6.93 63.32,6.93 D28.2
  Bottom 0.152: v28.64,18.59 38.7,18.59 v52.27,5.02
N$17
  Top 0.152: D29.2 15.84,15.31 19.2,15.31 23.46,11.04 33.45,11.04 34.82,9.67 D30.4
N$18
  Top 0.152: D30.2 29.94,6.32 33.29,6.32 34.21,5.4 35.43,5.4 37.33,7.31 37.33,10.81 13.79,34.36 11.12,34.36 D31.4
N$19  (via drill 0.35)
  Top 0.152: v6.24,33.14 6.24,31.16 D31.2 | v8.76,50.52 8.76,50.82 8.3,51.28 8.3,63.39 11.04,66.14 D32.4
  Bottom 0.152: v6.24,33.14 6.24,41.75 8.76,44.27 v8.76,50.52
N$20  (via drill 0.35)
  Top 0.152: v35.27,80.16 36.88,80.16 43.73,73.3 v56.23,73.3
  Bottom 0.152: v35.27,80.16 34.05,80.16 R19.1 | v56.23,73.3 61.18,78.25 65.6,78.25 66.82,79.47 IC1.12
RX
  Top 0.152: J1.2 63.24,64.53 63.24,66.52 60.19,69.56 60.19,71.39 57.68,73.91 45.26,73.91 41.45,77.72 41.45,79.47 IC1.2
S0
  Bottom 0.152: U1.10 46.09,60.88 44.27,62.71 44.27,67.81 45.56,69.11 45.56,78.56 46.48,79.47 IC1.4
S1
  Bottom 0.152: U1.11 44.8,54.93 44.8,60.88 42.97,62.71 42.97,77.11 44.95,79.09 44.95,79.78 46.02,80.84 47.7,80.84 48.99,79.55 IC1.5
S2
  Bottom 0.152: U1.14 44.88,64 44.88,66.36 48.08,69.56 48.08,72.54 51.58,76.04 51.58,79.47 IC1.6
S3  (via drill 0.35)
  Top 0.152: v50.9,76.27 61.03,76.27 64.23,79.47 IC1.11
  Bottom 0.152: v50.9,76.27 48.08,79.09 48.08,79.32 46.86,80.54 46.17,80.54 45.26,79.62 45.26,69.26 43.58,67.58 43.58,64 U1.13
TX
  Top 0.152: J1.1 65.75,64.53 65.75,66.52 62.78,69.49 62.78,69.72 56.84,75.66 47.85,75.66 44.04,79.47 IC1.3